# Altium schematic sheet AudioADC.SchDoc
size A4; SheetNumber: 9; SheetTotal: 10
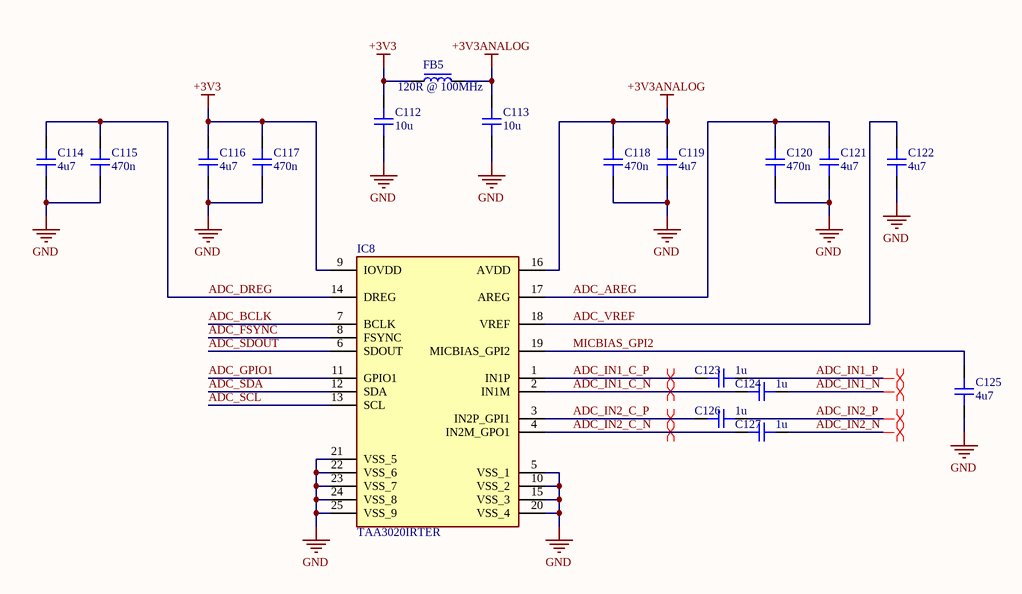
[diagram p0: AudioADC.SchDoc]

## Parts
C112  10u  [CAP_0805]
C113  10u  [CAP_0805]
C114  4u7  [CAP_0402]
C115  470n  [CAP_0201]
C116  4u7  [CAP_0402]
C117  470n  [CAP_0201]
C118  470n  [CAP_0201]
C119  4u7  [CAP_0402]
C120  470n  [CAP_0201]
C121  4u7  [CAP_0402]
C122  4u7  [CAP_0402]
C123  1u  [CAP_0402]
C124  1u  [CAP_0402]
C125  4u7  [CAP_0402]
C126  1u  [CAP_0402]
C127  1u  [CAP_0402]
FB5  120R @ 100MHz  [FB_0805]
IC8  TAA3020IRTER  [PCM1820IRTER]

## Nets
+3V3: C112.2 C116.2 C117.2 FB5.1 IC8.9(IOVDD)
+3V3ANALOG: C113.2 C118.2 C119.2 FB5.2 IC8.16(AVDD)
GND: C112.1 C113.1 C114.1 C115.1 C116.1 C117.1 C118.1 C119.1 C120.1 C121.1 C122.1 C125.1 IC8.5(VSS_1) IC8.10(VSS_2) IC8.15(VSS_3) IC8.20(VSS_4) IC8.21(VSS_5) IC8.22(VSS_6) IC8.23(VSS_7) IC8.24(VSS_8) IC8.25(VSS_9)
ADC_AREG: C120.2 C121.2 IC8.17(AREG)
ADC_BCLK: IC8.7(BCLK)
ADC_DREG: C114.2 C115.2 IC8.14(DREG)
ADC_FSYNC: IC8.8(FSYNC)
ADC_GPIO1: IC8.11(GPIO1)
ADC_IN1_C_N: C124.1 IC8.2(IN1M)
ADC_IN1_C_P: C123.1 IC8.1(IN1P)
ADC_IN1_N: C124.2
ADC_IN1_P: C123.2
ADC_IN2_C_N: C127.1 IC8.4(IN2M_GPO1)
ADC_IN2_C_P: C126.1 IC8.3(IN2P_GPI1)
ADC_IN2_N: C127.2
ADC_IN2_P: C126.2
ADC_SCL: IC8.13(SCL)
ADC_SDA: IC8.12(SDA)
ADC_SDOUT: IC8.6(SDOUT)
ADC_VREF: C122.2 IC8.18(VREF)
MICBIAS_GPI2: C125.2 IC8.19(MICBIAS_GPI2)

## Layout directives
differential pair: ADC_IN1_C_N, ADC_IN1_C_P, ADC_IN1_N, ADC_IN1_P, ADC_IN2_C_N, ADC_IN2_C_P, ADC_IN2_N, ADC_IN2_P

## Library data of the parts
C112 C113 = CAP_0805: Capacitor SMD 0805; Manufacturer: *; Manufacturer Part Number: *; Distributor Link: *; LCSC: *; Rating: *; Dielectric: *
C114 C116 C119 C121-C127 = CAP_0402: Capacitor SMD 0402; Manufacturer: *; Manufacturer Part Number: *; Distributor Link: *; LCSC: *; Rating: *; Dielectric: *
C115 C117 C118 C120 = CAP_0201: Capacitor SMD 0201; Manufacturer: *; Manufacturer Part Number: *; Distributor Link: *; LCSC: *; Rating: *; Dielectric: *
FB5 = FB_0805: Ferrite Bead SMD 0805; Manufacturer: *; Manufacturer Part Number: *; Distributor Link: *; LCSC: *
IC8 = TAA3020IRTER: Integrated Circuit; Manufacturer_Name: Texas Instruments; Datasheet Link: https://www.ti.com/lit/ds/symlink/taa3020.pdf?ts=1735147381281&ref_url=https%253A%252F%252Fwww.ti.com%252Fproduct%252FTAA3020; Height: 0.8mm; Manufacturer_Part_Number: TAA3020IRTER